# Altium project filtro_rev4.PrjPcb
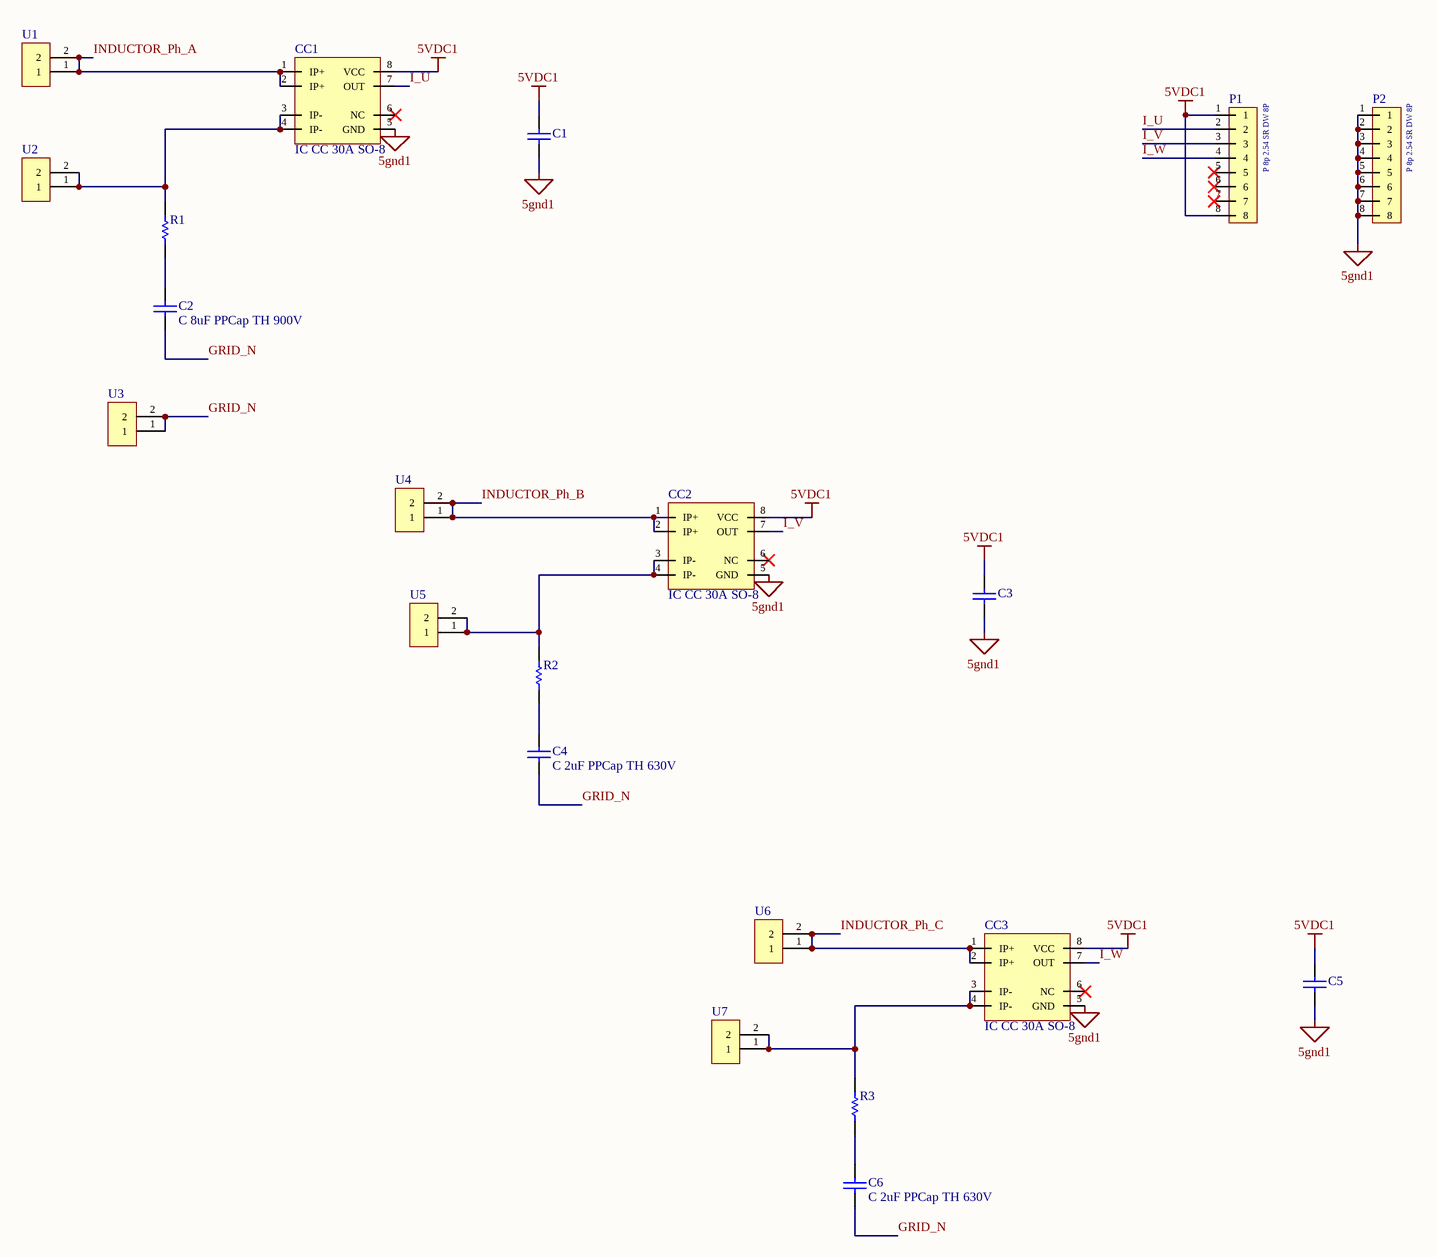
[diagram p0: filtro_rev4.SchDoc]
1 sheet, 21 parts. Net scope: global (net labels, ports and power ports of the same name join across sheets).
Board file: filtro_rev4.PcbDoc

## Sheet filtro_rev4.SchDoc
size A3

### Parts
C1  C 10uF 0805 MLCC 25V X5R  [CAPC_0805]  (value not drawn)
C2  C 8uF PPCap TH 900V  [PWR_CAP_PP_8u]
C3  C 10uF 0805 MLCC 25V X5R  [CAPC_0805]  (value not drawn)
C4  C 2uF PPCap TH 630V  [PWR_CAP_PP_8u]
C5  C 10uF 0805 MLCC 25V X5R  [CAPC_0805]  (value not drawn)
C6  C 2uF PPCap TH 630V  [PWR_CAP_PP_8u]
CC1  IC CC 30A SO-8  [CC6303_SOP8]
CC2  IC CC 30A SO-8  [CC6303_SOP8]
CC3  IC CC 30A SO-8  [CC6303_SOP8]
P1  P 8p 2.54 SR DW 8P  [Header 8x1 8.5mm]
P2  P 8p 2.54 SR DW 8P  [Header 8x1 8.5mm]
R1  R 2.2 3W TH 5%  [PWR_RESC_3W]  (value not drawn)
R2  R 2.2 3W TH 5%  [PWR_RESC_3W]  (value not drawn)
R3  R 2.2 3W TH 5%  [PWR_RESC_3W]  (value not drawn)
U1  P 2p 5mm  [connector1x2_parafuso]  (value not drawn)
U2  P 2p 5mm  [connector1x2_parafuso]  (value not drawn)
U3  P 2p 5mm  [connector1x2_parafuso]  (value not drawn)
U4  P 2p 5mm  [connector1x2_parafuso]  (value not drawn)
U5  P 2p 5mm  [connector1x2_parafuso]  (value not drawn)
U6  P 2p 5mm  [connector1x2_parafuso]  (value not drawn)
U7  P 2p 5mm  [connector1x2_parafuso]  (value not drawn)

### Nets
5gnd1: C1.1 C3.1 C5.1 CC1.5(GND) CC2.5(GND) CC3.5(GND) P2.1 P2.2 P2.3 P2.4 P2.5 P2.6 P2.7 P2.8
5VDC1: C1.2 C3.2 C5.2 CC1.8(VCC) CC2.8(VCC) CC3.8(VCC) P1.1 P1.8
GRID_N: C2.1 C4.1 C6.1 U3.1 U3.2
I_U: CC1.7(OUT) P1.2
I_V: CC2.7(OUT) P1.3
I_W: CC3.7(OUT) P1.4
INDUCTOR_Ph_A: CC1.1(IP+) CC1.2(IP+) U1.1 U1.2
INDUCTOR_Ph_B: CC2.1(IP+) CC2.2(IP+) U4.1 U4.2
INDUCTOR_Ph_C: CC3.1(IP+) CC3.2(IP+) U6.1 U6.2
NetC2_2: C2.2 R1.1
NetC4_2: C4.2 R2.1
NetC6_2: C6.2 R3.1
NetCC1_3: CC1.3(IP-) CC1.4(IP-) R1.2 U2.1 U2.2
NetCC2_3: CC2.3(IP-) CC2.4(IP-) R2.2 U5.1 U5.2
NetCC3_3: CC3.3(IP-) CC3.4(IP-) R3.2 U7.1 U7.2

Not connected (* = marked no-connect by the designer): CC1 6(NC)*; CC2 6(NC)*; CC3 6(NC)*; P1 5* 6* 7*

### Library data of the parts
C1 C3 C5 = Capacitor SMD: Capacitores de cerâmica multicamada MLCC - SMD/SMT 10uF 25V X5R +/-10% 0805 Gen Purp; Mouser VPN: 963-TMK212BBJ106KG-T; Price: 0,162; LCSC PART #: C15850
C2 = CAPACITOR_dcbus: Condensador de polipropileno PP KEMET, 8μF, ±5%, 900V dc, Montaje en orificio pasante; RS VPN: 137-2363; Price: 4,83
C4 C6 = CAPACITOR_dcbus: Capacitores de película 2.0uF 630volts 10% 37.5mmL/S 1.0mmL/D; Mouser VPN: 871-B32676E6205K; Price: 3,62
CC1-CC3 = Current_Sensor_cc6303: Sensores de Corrente de Montagem de Painel Hall Effect IC LF 30A 66 mV/A; Mouser VPN: 630-ACHS-7123-000E; Price: 3,47; LCSC PART #: C10681
P1 P2 = jumper_8p: Distribuidores e Alojamento de Fios CGrid Hrd SRDW THo le 8ckt; Mouser VPN: 538-87937-0800; Price: 0,621
R1-R3 = Resistor: Resistencia TE Connectivity, de 2.2Ω ±5%, 3W, Serie ROX3S; RS VPN: 214-2409; Price: 0,351
U1-U7 = gen_purpose_conn_1x2: Bloques de terminales de PCB de perfil estándar RS de 5,0 mm; RS VPN: 896-6696; Price: 0,24